# Altium schematic sheet LEDS2.SchDoc: LEDBO - LRTBR98G (LEDS 2)
size B; Author: Sébastien Gélinas; Organization: SmartHalo; Address1: 5445 de Gaspé; Address2: Montréal, QC; Address3: Canada; Address4: H2T 3B2; Revision: 1; SheetNumber: 4; SheetTotal: 4
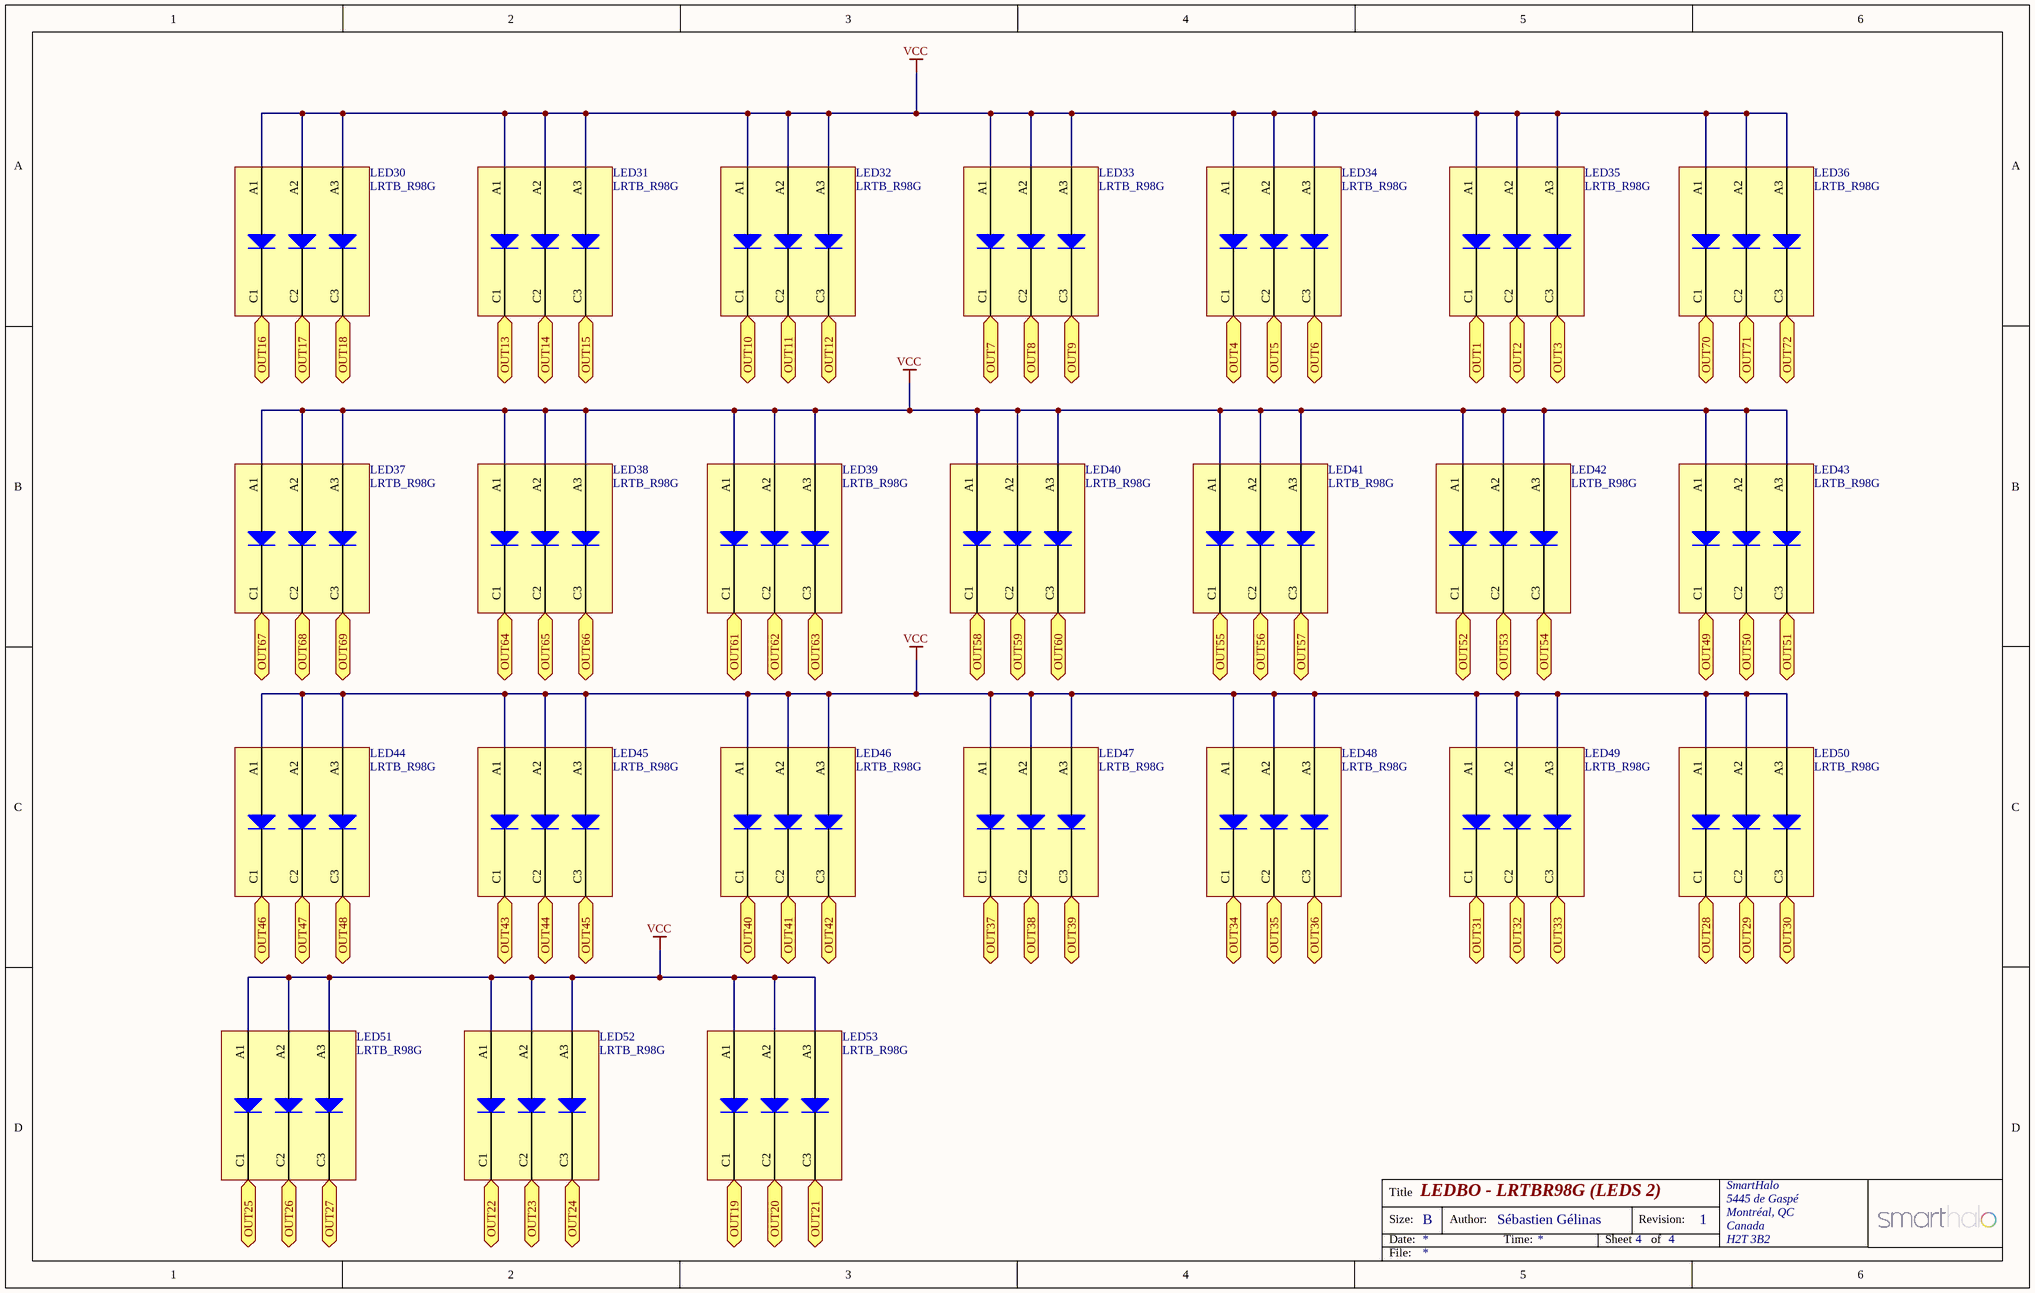
[diagram p0: LEDS2.SchDoc]

## Parts
LED30  LRTB_R98G  [LRTB_R98G]
LED31  LRTB_R98G  [LRTB_R98G]
LED32  LRTB_R98G  [LRTB_R98G]
LED33  LRTB_R98G  [LRTB_R98G]
LED34  LRTB_R98G  [LRTB_R98G]
LED35  LRTB_R98G  [LRTB_R98G]
LED36  LRTB_R98G  [LRTB_R98G]
LED37  LRTB_R98G  [LRTB_R98G]
LED38  LRTB_R98G  [LRTB_R98G]
LED39  LRTB_R98G  [LRTB_R98G]
LED40  LRTB_R98G  [LRTB_R98G]
LED41  LRTB_R98G  [LRTB_R98G]
LED42  LRTB_R98G  [LRTB_R98G]
LED43  LRTB_R98G  [LRTB_R98G]
LED44  LRTB_R98G  [LRTB_R98G]
LED45  LRTB_R98G  [LRTB_R98G]
LED46  LRTB_R98G  [LRTB_R98G]
LED47  LRTB_R98G  [LRTB_R98G]
LED48  LRTB_R98G  [LRTB_R98G]
LED49  LRTB_R98G  [LRTB_R98G]
LED50  LRTB_R98G  [LRTB_R98G]
LED51  LRTB_R98G  [LRTB_R98G]
LED52  LRTB_R98G  [LRTB_R98G]
LED53  LRTB_R98G  [LRTB_R98G]

## Ports
OUT1, OUT2, OUT3, OUT4, OUT5, OUT6, OUT7, OUT8, OUT9, OUT10, OUT11, OUT12, OUT13, OUT14, OUT15, OUT16, OUT17, OUT18, OUT19, OUT20, OUT21, OUT22, OUT23, OUT24, OUT25, OUT26, OUT27, OUT28, OUT29, OUT30, OUT31, OUT32, OUT33, OUT34, OUT35, OUT36, OUT37, OUT38, OUT39, OUT40, OUT41, OUT42, OUT43, OUT44, OUT45, OUT46, OUT47, OUT48, OUT49, OUT50, OUT51, OUT52, OUT53, OUT54, OUT55, OUT56, OUT57, OUT58, OUT59, OUT60, OUT61, OUT62, OUT63, OUT64, OUT65, OUT66, OUT67, OUT68, OUT69, OUT70, OUT71, OUT72

## Nets
VCC: LED30.A1(Anode_Blue) LED30.A2(Anode_Green) LED30.A3(Anode_Red) LED31.A1(Anode_Blue) LED31.A2(Anode_Green) LED31.A3(Anode_Red) LED32.A1(Anode_Blue) LED32.A2(Anode_Green) LED32.A3(Anode_Red) LED33.A1(Anode_Blue) LED33.A2(Anode_Green) LED33.A3(Anode_Red) LED34.A1(Anode_Blue) LED34.A2(Anode_Green) LED34.A3(Anode_Red) LED35.A1(Anode_Blue) LED35.A2(Anode_Green) LED35.A3(Anode_Red) LED36.A1(Anode_Blue) LED36.A2(Anode_Green) LED36.A3(Anode_Red) LED37.A1(Anode_Blue) LED37.A2(Anode_Green) LED37.A3(Anode_Red) LED38.A1(Anode_Blue) LED38.A2(Anode_Green) LED38.A3(Anode_Red) LED39.A1(Anode_Blue) LED39.A2(Anode_Green) LED39.A3(Anode_Red) LED40.A1(Anode_Blue) LED40.A2(Anode_Green) LED40.A3(Anode_Red) LED41.A1(Anode_Blue) LED41.A2(Anode_Green) LED41.A3(Anode_Red) LED42.A1(Anode_Blue) LED42.A2(Anode_Green) LED42.A3(Anode_Red) LED43.A1(Anode_Blue) LED43.A2(Anode_Green) LED43.A3(Anode_Red) LED44.A1(Anode_Blue) LED44.A2(Anode_Green) LED44.A3(Anode_Red) LED45.A1(Anode_Blue) LED45.A2(Anode_Green) LED45.A3(Anode_Red) LED46.A1(Anode_Blue) LED46.A2(Anode_Green) LED46.A3(Anode_Red) LED47.A1(Anode_Blue) LED47.A2(Anode_Green) LED47.A3(Anode_Red) LED48.A1(Anode_Blue) LED48.A2(Anode_Green) LED48.A3(Anode_Red) LED49.A1(Anode_Blue) LED49.A2(Anode_Green) LED49.A3(Anode_Red) LED50.A1(Anode_Blue) LED50.A2(Anode_Green) LED50.A3(Anode_Red) LED51.A1(Anode_Blue) LED51.A2(Anode_Green) LED51.A3(Anode_Red) LED52.A1(Anode_Blue) LED52.A2(Anode_Green) LED52.A3(Anode_Red) LED53.A1(Anode_Blue) LED53.A2(Anode_Green) LED53.A3(Anode_Red)
OUT1: LED35.C1(Cathode_Blue) ; port OUT1
OUT2: LED35.C2(Cathode_Green) ; port OUT2
OUT3: LED35.C3(Cathode_Red) ; port OUT3
OUT4: LED34.C1(Cathode_Blue) ; port OUT4
OUT5: LED34.C2(Cathode_Green) ; port OUT5
OUT6: LED34.C3(Cathode_Red) ; port OUT6
OUT7: LED33.C1(Cathode_Blue) ; port OUT7
OUT8: LED33.C2(Cathode_Green) ; port OUT8
OUT9: LED33.C3(Cathode_Red) ; port OUT9
OUT10: LED32.C1(Cathode_Blue) ; port OUT10
OUT11: LED32.C2(Cathode_Green) ; port OUT11
OUT12: LED32.C3(Cathode_Red) ; port OUT12
OUT13: LED31.C1(Cathode_Blue) ; port OUT13
OUT14: LED31.C2(Cathode_Green) ; port OUT14
OUT15: LED31.C3(Cathode_Red) ; port OUT15
OUT16: LED30.C1(Cathode_Blue) ; port OUT16
OUT17: LED30.C2(Cathode_Green) ; port OUT17
OUT18: LED30.C3(Cathode_Red) ; port OUT18
OUT19: LED53.C1(Cathode_Blue) ; port OUT19
OUT20: LED53.C2(Cathode_Green) ; port OUT20
OUT21: LED53.C3(Cathode_Red) ; port OUT21
OUT22: LED52.C1(Cathode_Blue) ; port OUT22
OUT23: LED52.C2(Cathode_Green) ; port OUT23
OUT24: LED52.C3(Cathode_Red) ; port OUT24
OUT25: LED51.C1(Cathode_Blue) ; port OUT25
OUT26: LED51.C2(Cathode_Green) ; port OUT26
OUT27: LED51.C3(Cathode_Red) ; port OUT27
OUT28: LED50.C1(Cathode_Blue) ; port OUT28
OUT29: LED50.C2(Cathode_Green) ; port OUT29
OUT30: LED50.C3(Cathode_Red) ; port OUT30
OUT31: LED49.C1(Cathode_Blue) ; port OUT31
OUT32: LED49.C2(Cathode_Green) ; port OUT32
OUT33: LED49.C3(Cathode_Red) ; port OUT33
OUT34: LED48.C1(Cathode_Blue) ; port OUT34
OUT35: LED48.C2(Cathode_Green) ; port OUT35
OUT36: LED48.C3(Cathode_Red) ; port OUT36
OUT37: LED47.C1(Cathode_Blue) ; port OUT37
OUT38: LED47.C2(Cathode_Green) ; port OUT38
OUT39: LED47.C3(Cathode_Red) ; port OUT39
OUT40: LED46.C1(Cathode_Blue) ; port OUT40
OUT41: LED46.C2(Cathode_Green) ; port OUT41
OUT42: LED46.C3(Cathode_Red) ; port OUT42
OUT43: LED45.C1(Cathode_Blue) ; port OUT43
OUT44: LED45.C2(Cathode_Green) ; port OUT44
OUT45: LED45.C3(Cathode_Red) ; port OUT45
OUT46: LED44.C1(Cathode_Blue) ; port OUT46
OUT47: LED44.C2(Cathode_Green) ; port OUT47
OUT48: LED44.C3(Cathode_Red) ; port OUT48
OUT49: LED43.C1(Cathode_Blue) ; port OUT49
OUT50: LED43.C2(Cathode_Green) ; port OUT50
OUT51: LED43.C3(Cathode_Red) ; port OUT51
OUT52: LED42.C1(Cathode_Blue) ; port OUT52
OUT53: LED42.C2(Cathode_Green) ; port OUT53
OUT54: LED42.C3(Cathode_Red) ; port OUT54
OUT55: LED41.C1(Cathode_Blue) ; port OUT55
OUT56: LED41.C2(Cathode_Green) ; port OUT56
OUT57: LED41.C3(Cathode_Red) ; port OUT57
OUT58: LED40.C1(Cathode_Blue) ; port OUT58
OUT59: LED40.C2(Cathode_Green) ; port OUT59
OUT60: LED40.C3(Cathode_Red) ; port OUT60
OUT61: LED39.C1(Cathode_Blue) ; port OUT61
OUT62: LED39.C2(Cathode_Green) ; port OUT62
OUT63: LED39.C3(Cathode_Red) ; port OUT63
OUT64: LED38.C1(Cathode_Blue) ; port OUT64
OUT65: LED38.C2(Cathode_Green) ; port OUT65
OUT66: LED38.C3(Cathode_Red) ; port OUT66
OUT67: LED37.C1(Cathode_Blue) ; port OUT67
OUT68: LED37.C2(Cathode_Green) ; port OUT68
OUT69: LED37.C3(Cathode_Red) ; port OUT69
OUT70: LED36.C1(Cathode_Blue) ; port OUT70
OUT71: LED36.C2(Cathode_Green) ; port OUT71
OUT72: LED36.C3(Cathode_Red) ; port OUT72

## Notes on the sheet
- Title
- Size:
- Date:
- B
- Author:
- Time:
- Sheet
- Revision:
- of
- File:

## Library data of the parts
LED30-LED53 = LRTB_R98G: IC RGB LED OSRAM; Manufacturer: OSRAM